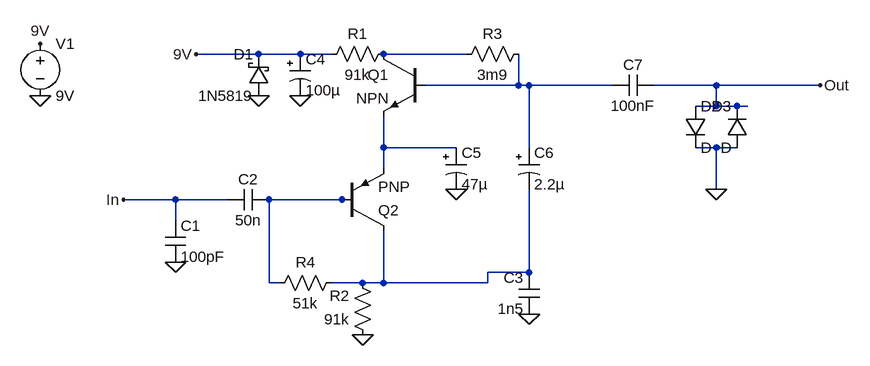
[diagram p0: schematic Draft3.asc]
Draft3.asc, the LTspice schematic file:
Version 4
SHEET 1 1012 680
WIRE 96 96 0 96
WIRE 160 96 96 96
WIRE 208 96 160 96
WIRE 416 96 288 96
WIRE 496 144 496 96
WIRE 496 144 352 144
WIRE 512 144 496 144
WIRE 640 144 512 144
WIRE 800 144 704 144
WIRE 960 144 800 144
WIRE 800 176 800 144
WIRE 800 176 768 176
WIRE 832 176 800 176
WIRE 848 176 832 176
WIRE 288 240 288 192
WIRE 400 240 288 240
WIRE 512 240 512 144
WIRE 800 240 768 240
WIRE 832 240 800 240
WIRE 288 272 288 240
WIRE 800 304 800 240
WIRE -32 320 -112 320
WIRE 48 320 -32 320
WIRE 224 320 112 320
WIRE 240 320 224 320
WIRE -32 352 -32 320
WIRE 512 432 512 304
WIRE 512 432 448 432
WIRE 112 448 112 320
WIRE 128 448 112 448
WIRE 256 448 208 448
WIRE 288 448 288 368
WIRE 288 448 256 448
WIRE 448 448 448 432
WIRE 448 448 288 448
FLAG 0 96 9V
FLAG 960 144 Out
FLAG -112 320 In
FLAG -32 416 0
FLAG 256 528 0
FLAG 512 496 0
FLAG 400 304 0
FLAG 800 304 0
FLAG 160 160 0
FLAG 96 160 0
FLAG -240 80 9V
FLAG -240 160 0
SYMBOL res 272 544 R180
WINDOW 0 36 76 Left 2
WINDOW 3 36 40 Left 2
SYMATTR InstName R2
SYMATTR Value 91k
SYMBOL cap -48 352 R0
SYMATTR InstName C1
SYMATTR Value 100pF
SYMBOL cap 112 304 R90
WINDOW 0 0 32 VBottom 2
WINDOW 3 32 32 VTop 2
SYMATTR InstName C2
SYMATTR Value 50n
SYMBOL cap 528 496 R180
WINDOW 0 24 56 Left 2
WINDOW 3 24 8 Left 2
SYMATTR InstName C3
SYMATTR Value 1n5
SYMBOL res 224 432 R90
WINDOW 0 0 56 VBottom 2
WINDOW 3 32 56 VTop 2
SYMATTR InstName R4
SYMATTR Value 51k
SYMBOL polcap 144 96 R0
WINDOW 3 24 56 Left 2
SYMATTR InstName C4
SYMATTR Value 100µ
SYMATTR Description Capacitor
SYMATTR Type cap
SYMATTR SpiceLine Rser=310m Lser=0 mfg="Nichicon" pn="UPR1J101MPH" type="Al electrolytic"
SYMBOL schottky 112 160 R180
WINDOW 0 24 64 Left 2
WINDOW 3 24 0 Left 2
SYMATTR InstName D1
SYMATTR Value 1N5819
SYMATTR Description Diode
SYMATTR Type diode
SYMBOL res 304 80 R90
WINDOW 0 0 56 VBottom 2
WINDOW 3 32 56 VTop 2
SYMATTR InstName R1
SYMATTR Value 91k
SYMBOL npn 352 96 M0
SYMATTR InstName Q1
SYMBOL pnp 224 368 M180
SYMATTR InstName Q2
SYMBOL polcap 384 240 R0
WINDOW 3 24 56 Left 2
SYMATTR InstName C5
SYMATTR Value 47µ
SYMATTR Description Capacitor
SYMATTR Type cap
SYMATTR SpiceLine Rser=800m Lser=0 mfg="Nichicon" pn="UPR1H470MPH" type="Al electrolytic"
SYMBOL polcap 496 240 R0
WINDOW 3 24 56 Left 2
SYMATTR InstName C6
SYMATTR Value 2.2µ
SYMATTR Description Capacitor
SYMATTR Type cap
SYMATTR SpiceLine Rser=10 Lser=0 mfg="Nichicon" pn="UPR1H2R2MAH" type="Al electrolytic"
SYMBOL res 512 80 R90
WINDOW 0 0 56 VBottom 2
WINDOW 3 32 56 VTop 2
SYMATTR InstName R3
SYMATTR Value 3m9
SYMBOL cap 704 128 R90
WINDOW 0 0 32 VBottom 2
WINDOW 3 32 32 VTop 2
SYMATTR InstName C7
SYMATTR Value 100nF
SYMBOL diode 752 176 R0
SYMATTR InstName D2
SYMBOL diode 848 240 R180
WINDOW 0 24 64 Left 2
WINDOW 3 24 0 Left 2
SYMATTR InstName D3
SYMBOL voltage -240 64 R0
SYMATTR InstName V1
SYMATTR Value 9V

The netlist it stands for:
* Draft3.asc
R2 0 N005 91k
C1 In 0 100pF
C2 N004 In 50n
C3 0 N005 1n5
R4 N005 N004 51k
C4 9V 0 100µ Rser=310m Lser=0 mfg="Nichicon" pn="UPR1J101MPH" type="Al electrolytic"
D1 0 9V 1N5819
R1 N001 9V 91k
Q1 N001 N002 N003 0 NPN
Q2 N005 N004 N003 0 PNP
C5 N003 0 47µ Rser=800m Lser=0 mfg="Nichicon" pn="UPR1H470MPH" type="Al electrolytic"
C6 N002 N005 2.2µ Rser=10 Lser=0 mfg="Nichicon" pn="UPR1H2R2MAH" type="Al electrolytic"
R3 N002 N001 3m9
C7 Out N002 100nF
D2 Out 0 D
D3 0 Out D
V1 9V 0 9V
.model D D
.lib standard.dio
.model NPN NPN
.model PNP PNP
.lib standard.bjt
.backanno
.end